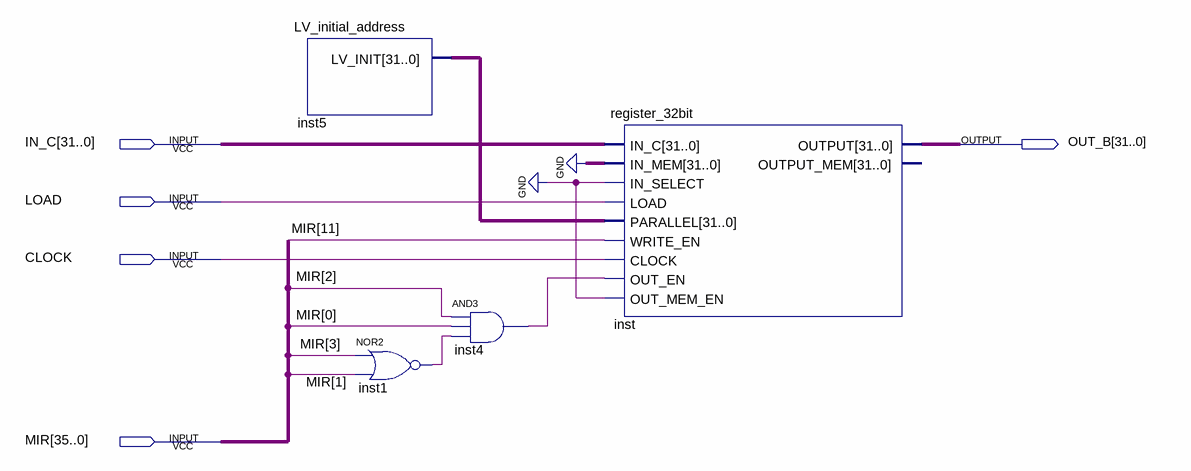
[diagram p0: schematic sheet]
// Quartus schematic LV.bdf as structural Verilog: 4 symbols, 5 pins
module LV (
  input  [31:0] IN_C,
  input  LOAD,
  input  CLOCK,
  input  [35:0] MIR,
  output [31:0] OUT_B
);

  wire inst1_out, inst4_out;
  wire [31:0] inst5_lv_init;

  LV_initial_address inst5 (.LV_INIT(inst5_lv_init));
  nor inst1 (inst1_out, MIR[3], MIR[1]);
  and inst4 (inst4_out, MIR[2], MIR[0], inst1_out);
  register_32bit inst (
    .IN_C(IN_C), .IN_MEM({32{1'b0}}), .IN_SELECT(1'b0), .LOAD(LOAD), .PARALLEL(inst5_lv_init),
    .WRITE_EN(MIR[11]), .CLOCK(CLOCK), .OUT_EN(inst4_out), .OUT_MEM_EN(1'b0), .OUTPUT(OUT_B));  // open: OUTPUT_MEM
endmodule
